# Altium schematic sheet SCHE.SchDoc
size A4; PageSetup: Record=PageOptions|CenterHorizontal=True|CenterVertical=True|PrintScale=1.00|XCorrection=1.00|YCorrection=1.00|PrintKind=2|BorderSize=5000000|LeftOffset=0|BottomOffset=0|Orientation=2|PaperLength=1000|PaperWidth=1000|Scale=100|PaperSource=7|PrintQuality=-4|MediaType=1|DitherType=10|PaperKind=A3|PrintScaleMode=0
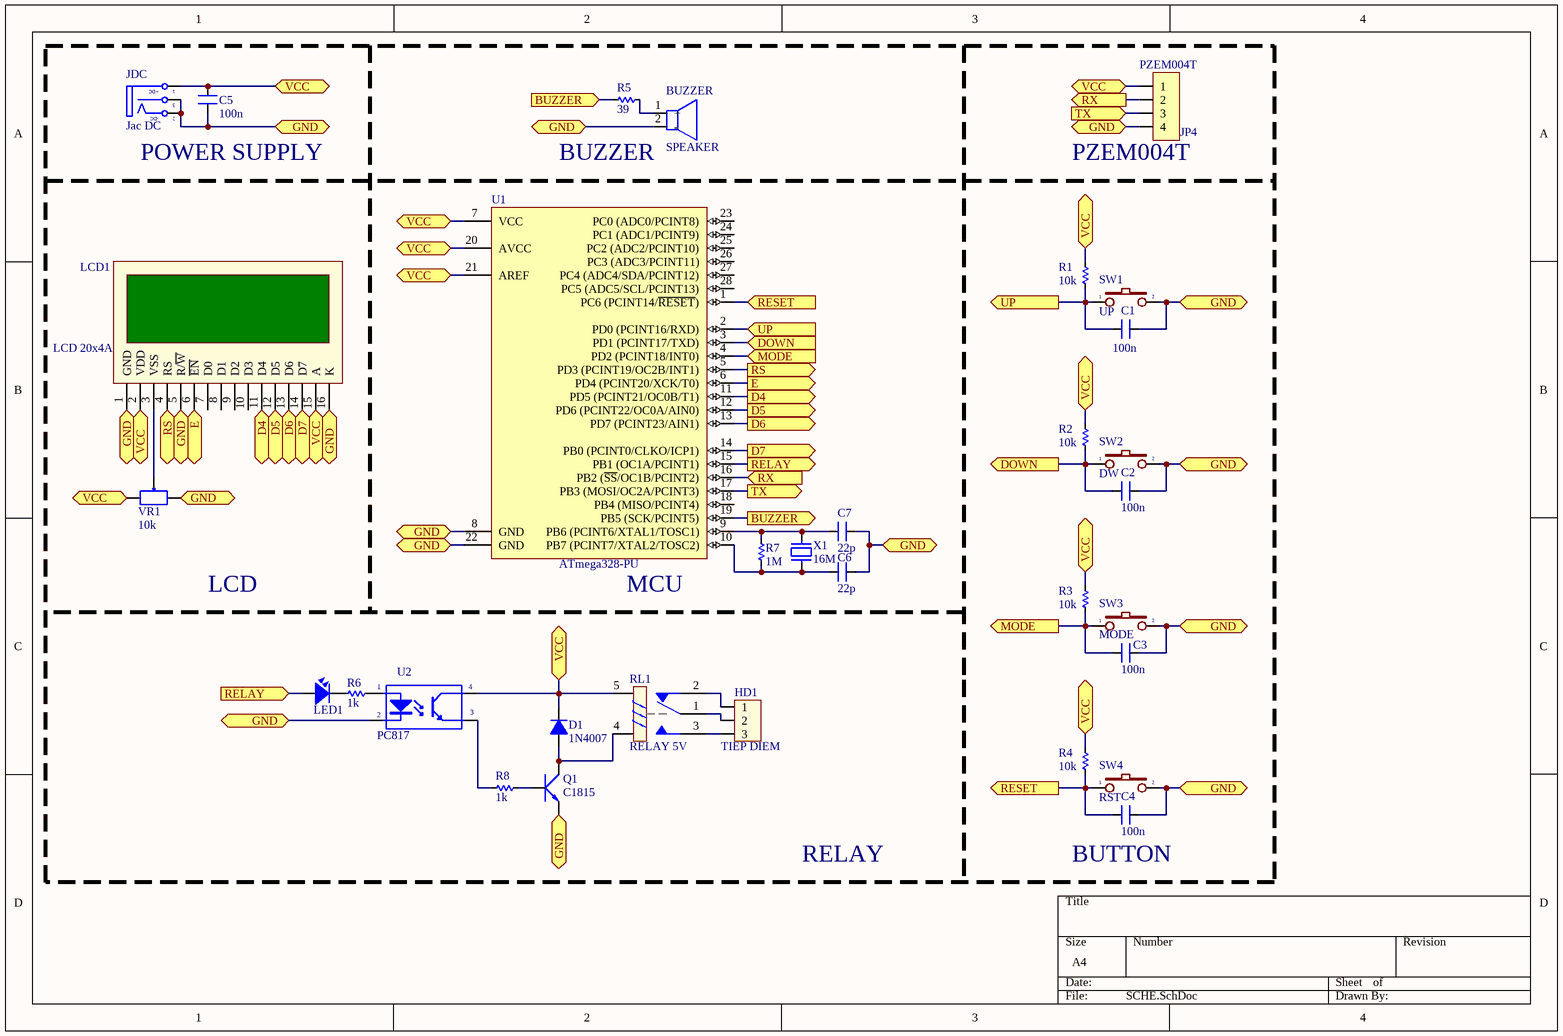
[diagram p0: SCHE.SchDoc]

## Parts
BUZZER  SPEAKER  [speaker]
C1  100n  [CN1]
C2  100n  [CN1]
C3  100n  [CN1]
C4  100n  [CN1]
C5  100n  [CN1]
C6  22p  [CN1]
C7  22p  [CN1]
D1  1N4007  [D1A]
HD1  TIEP DIEM  [HED3]
JDC  Jac DC  [DC0]
LCD1  LCD 20x4A  [LCD20X4A]
LED1  LED  [LED-3MM-YELLOW]  (value not drawn)
PZEM004T  JP4  [JP4-C1T]
Q1  C1815  [QTO-92]
R1  10k  [RES-1/4W-SMALL]
R2  10k  [RES-1/4W-SMALL]
R3  10k  [RES-1/4W-SMALL]
R4  10k  [RES-1/4W-SMALL]
R5  39  [RES-1/4W-SMALL]
R6  1k  [RES-1/4W-SMALL]
R7  1M  [RES-1/4W-SMALL]
R8  1k  [RES-1/4W-SMALL]
RL1  RELAY 5V  [RL_SPDT_10A]
SW1  UP  [SW2]
SW2  DW  [SW2]
SW3  MODE  [SW2]
SW4  RST  [SW2]
U1  ATmega328-PU  [DIP28]
U2  PC817  [DIP4/W0.3]
VR1  10k  [VR]
X1  16M  [XT2]

## Ports
BUZZER (in), BUZZER (out), D4 (in), D4 (out), D5 (in), D5 (out), D6 (in), D6 (out), D7 (in), D7 (out), DOWN (in), DOWN (out), E (in), E (out), GND, MODE (in), MODE (out), RELAY (in), RELAY (out), RESET (in), RESET (out), RS (in), RS (out), RX (in), RX (out), TX (in), TX (out), UP (in), UP (out), VCC

## Nets
BUZZER: R5.2 U1.19(PB5_(SCK/PCINT5)) ; port BUZZER
D4: LCD1.11(D4) U1.11(PD5_(PCINT21/OC0B/T1)) ; port D4
D5: LCD1.12(D5) U1.12(PD6_(PCINT22/OC0A/AIN0)) ; port D5
D6: LCD1.13(D6) U1.13(PD7_(PCINT23/AIN1)) ; port D6
D7: LCD1.14(D7) U1.14(PB0_(PCINT0/CLKO/ICP1)) ; port D7
DOWN: C2.1 R2.2 SW2.1 U1.3(PD1_(PCINT17/TXD)) ; port DOWN
E: LCD1.6(~{EN}) U1.6(PD4_(PCINT20/XCK/T0)) ; port E
GND: BUZZER.2(-) C1.2 C2.2 C3.2 C4.2 C5.1 C6.1 C7.2 JDC.2(TN) JDC.3(S) LCD1.1(GND) LCD1.5(R/~{W}) LCD1.16(K) PZEM004T.4 Q1.1(E) SW1.2 SW2.2 SW3.2 SW4.2 U1.8(GND) U1.22(GND) U2.2(K) VR1.3 ; port GND
MODE: C3.1 R3.2 SW3.1 U1.4(PD2_(PCINT18/INT0)) ; port MODE
RELAY: LED1.1 U1.15(PB1_(OC1A/PCINT1)) ; port RELAY
RESET: C4.1 R4.2 SW4.1 U1.1(PC6_(PCINT14/~{RESET})) ; port RESET
RS: LCD1.4(RS) U1.5(PD3_(PCINT19/OC2B/INT1)) ; port RS
RX: PZEM004T.2 U1.16(PB2_(~{SS}/OC1B/PCINT2)) ; port RX
TX: PZEM004T.3 U1.17(PB3_(MOSI/OC2A/PCINT3)) ; port TX
UP: C1.1 R1.2 SW1.1 U1.2(PD0_(PCINT16/RXD)) ; port UP
VCC: C5.2 D1.2(K) JDC.1(T) LCD1.2(VDD) LCD1.15(A) PZEM004T.1 R1.1 R2.1 R3.1 R4.1 RL1.5 U1.7(VCC) U1.20(AVCC) U1.21(AREF) U2.4(C) VR1.1 ; port VCC
NetBUZZER_1: BUZZER.1(+) R5.1
NetC6_2: C6.2 R7.2 U1.10(PB7_(PCINT7/XTAL2/TOSC2)) X1.2
NetC7_1: C7.1 R7.1 U1.9(PB6_(PCINT6/XTAL1/TOSC1)) X1.1
NetD1_1: D1.1(A) Q1.2(C) RL1.4
NetHD1_1: HD1.1 RL1.2
NetHD1_2: HD1.2 RL1.1
NetHD1_3: HD1.3 RL1.3
NetLCD1_3: LCD1.3(VSS) VR1.2
NetLED1_2: LED1.2 R6.2
NetQ1_3: Q1.3(B) R8.2
NetR6_1: R6.1 U2.1(A)
NetR8_1: R8.1 U2.3(E)

Not connected (* = marked no-connect by the designer): LCD1 7(D0) 8(D1) 9(D2) 10(D3); U1 18(PB4_(MISO/PCINT4)) 23(PC0_(ADC0/PCINT8)) 24(PC1_(ADC1/PCINT9)) 25(PC2_(ADC2/PCINT10)) 26(PC3_(ADC3/PCINT11)) 27(PC4_(ADC4/SDA/PCINT12)) 28(PC5_(ADC5/SCL/PCINT13))

## Notes on the sheet
- POWER SUPPLY
- BUZZER
- (near PZEM004T) PZEM004T
- LCD
- (near U1) MCU
- RELAY
- (near C4) BUTTON
- (in symbol DCIN) +DC; -DC

## Library data of the parts
BUZZER = SPEAKER: Vendor: Digikey; Published: 13-April-2009; Publisher: Hoang Nguyen; ComponentLink1Description: Digikey Part Link; ComponentLink2Description: Open Datasheet; ComponentLink2URL: H:\LIBRARY\LIBRARY.Datasheet\
C1-C7 = CN1: Cap np  1pF - 472pF; Value: 100pF
D1 = D1A: Diode 1A; Value: 1N4007
HD1 = Hed3: Header 3 (Green); Value: Header 3
JDC = DCIN: Jac DC input; Value: Jac DC
LCD1 = LCD20x4A: LCD dipslay 20 char, 4 line; Value: Jum 40; Value: LCD 20x4A
LED1 = LED: LED Single colour Green and Red; Value: LED 3 ly Single Colour
PZEM004T = JP4: WR-PHD 2.54 mm Angled Socket Header; Manufacturer: W¨¹rth Elektronik eiSos GmbH; partNo: 613004143121; ComponentLink1 Description: Manufacturer; ComponentLink2 Description: Datasheet; NoPins: 04; Created Date: 29 March 2013; ComponentLink1URL: http://www.we-online.com; ComponentLink2URL: http://katalog.we-online.de/em/datasheet/6130xx143121.pdf; Created by: Karrer Zheng
Q1 = C1815: NPN 600mW, ECB; Value: C1815
R1-R8 = Res: Manufacturer: Generic Components; Class: Passive; SubClass: R; Published: 08/06/2000; Publisher: Altium Hobart Technology Centre
RL1 = Relay 1: Relay SPDT,10A - 12VDC 5 Pin; Value: Relay SPDT, 10A, 12V
SW1-SW4 = SW2: Switch button 2 pin; Value: SW chip 2 pin
U1 = ATmega328-PU: 8-bit AVR Microcontroller, 32KB Flash, 1KB EEPROM, 2KB SRAM, 28-pin PDIP, Industrial Grade (-40°C to 85°C); Published: 1-Apr-2010; DatasheetVersion: revA, Jan-2010; PackageVersion: revB, Sep-2001; PackageReference: 28P3; Publisher: Altium Limited; PackageDescription: 28-lead (0.300"/7.62mm Wide) Plastic Dual Inline Package (PDIP); Supplier 1: Digi-Key; Supplier Part Number 1: ATMEGA328-PU-ND; Supplier 2: Mouser; Supplier Part Number 2: 556-ATMEGA328-PU; ComponentLink1Description: Manufacturer Link; ComponentLink1URL: http://www.atmel.com/products/avr/default.asp?; ComponentLink2Description: ATmega48A/48PA/88A/88PA/168A/168PA/328/328P Datasheet; ComponentLink2URL: http://www.atmel.com/dyn/resources/prod_documents/8271.pdf; ComponentLink3Description: ATmega48A/48PA/88A/88PA/168A/168PA/328/328P Summary; ComponentLink3URL: http://www.atmel.com/dyn/resources/prod_documents/8271S.pdf; ComponentLink4Description: Atmel.com Home; ComponentLink4URL: http://www.atmel.com
U2 = PC817: Single Opto; Value: PC817
VR1 = VR: Var Resistor; Value: VR 10K
X1 = XT2: Crystal For all Crystal 2pin.; Value: 4Mhz